# EasyEDA Pro project ProPrj_DOGlove_MainBoard.epro, schematic DOGlove_MainCircuit

## Sheets
1 STM32F042: Board Name: DOGlove_MainBoard; Create Date: 2025-04-19; Page Name: STM32F042; Project Name: DOGlove_MainBoard; Schematic Name: DOGlove_MainCircuit; Update Date: 2025-05-10; Company: Tsinghua TEA Lab; Page Size: A4; Version: V1.0
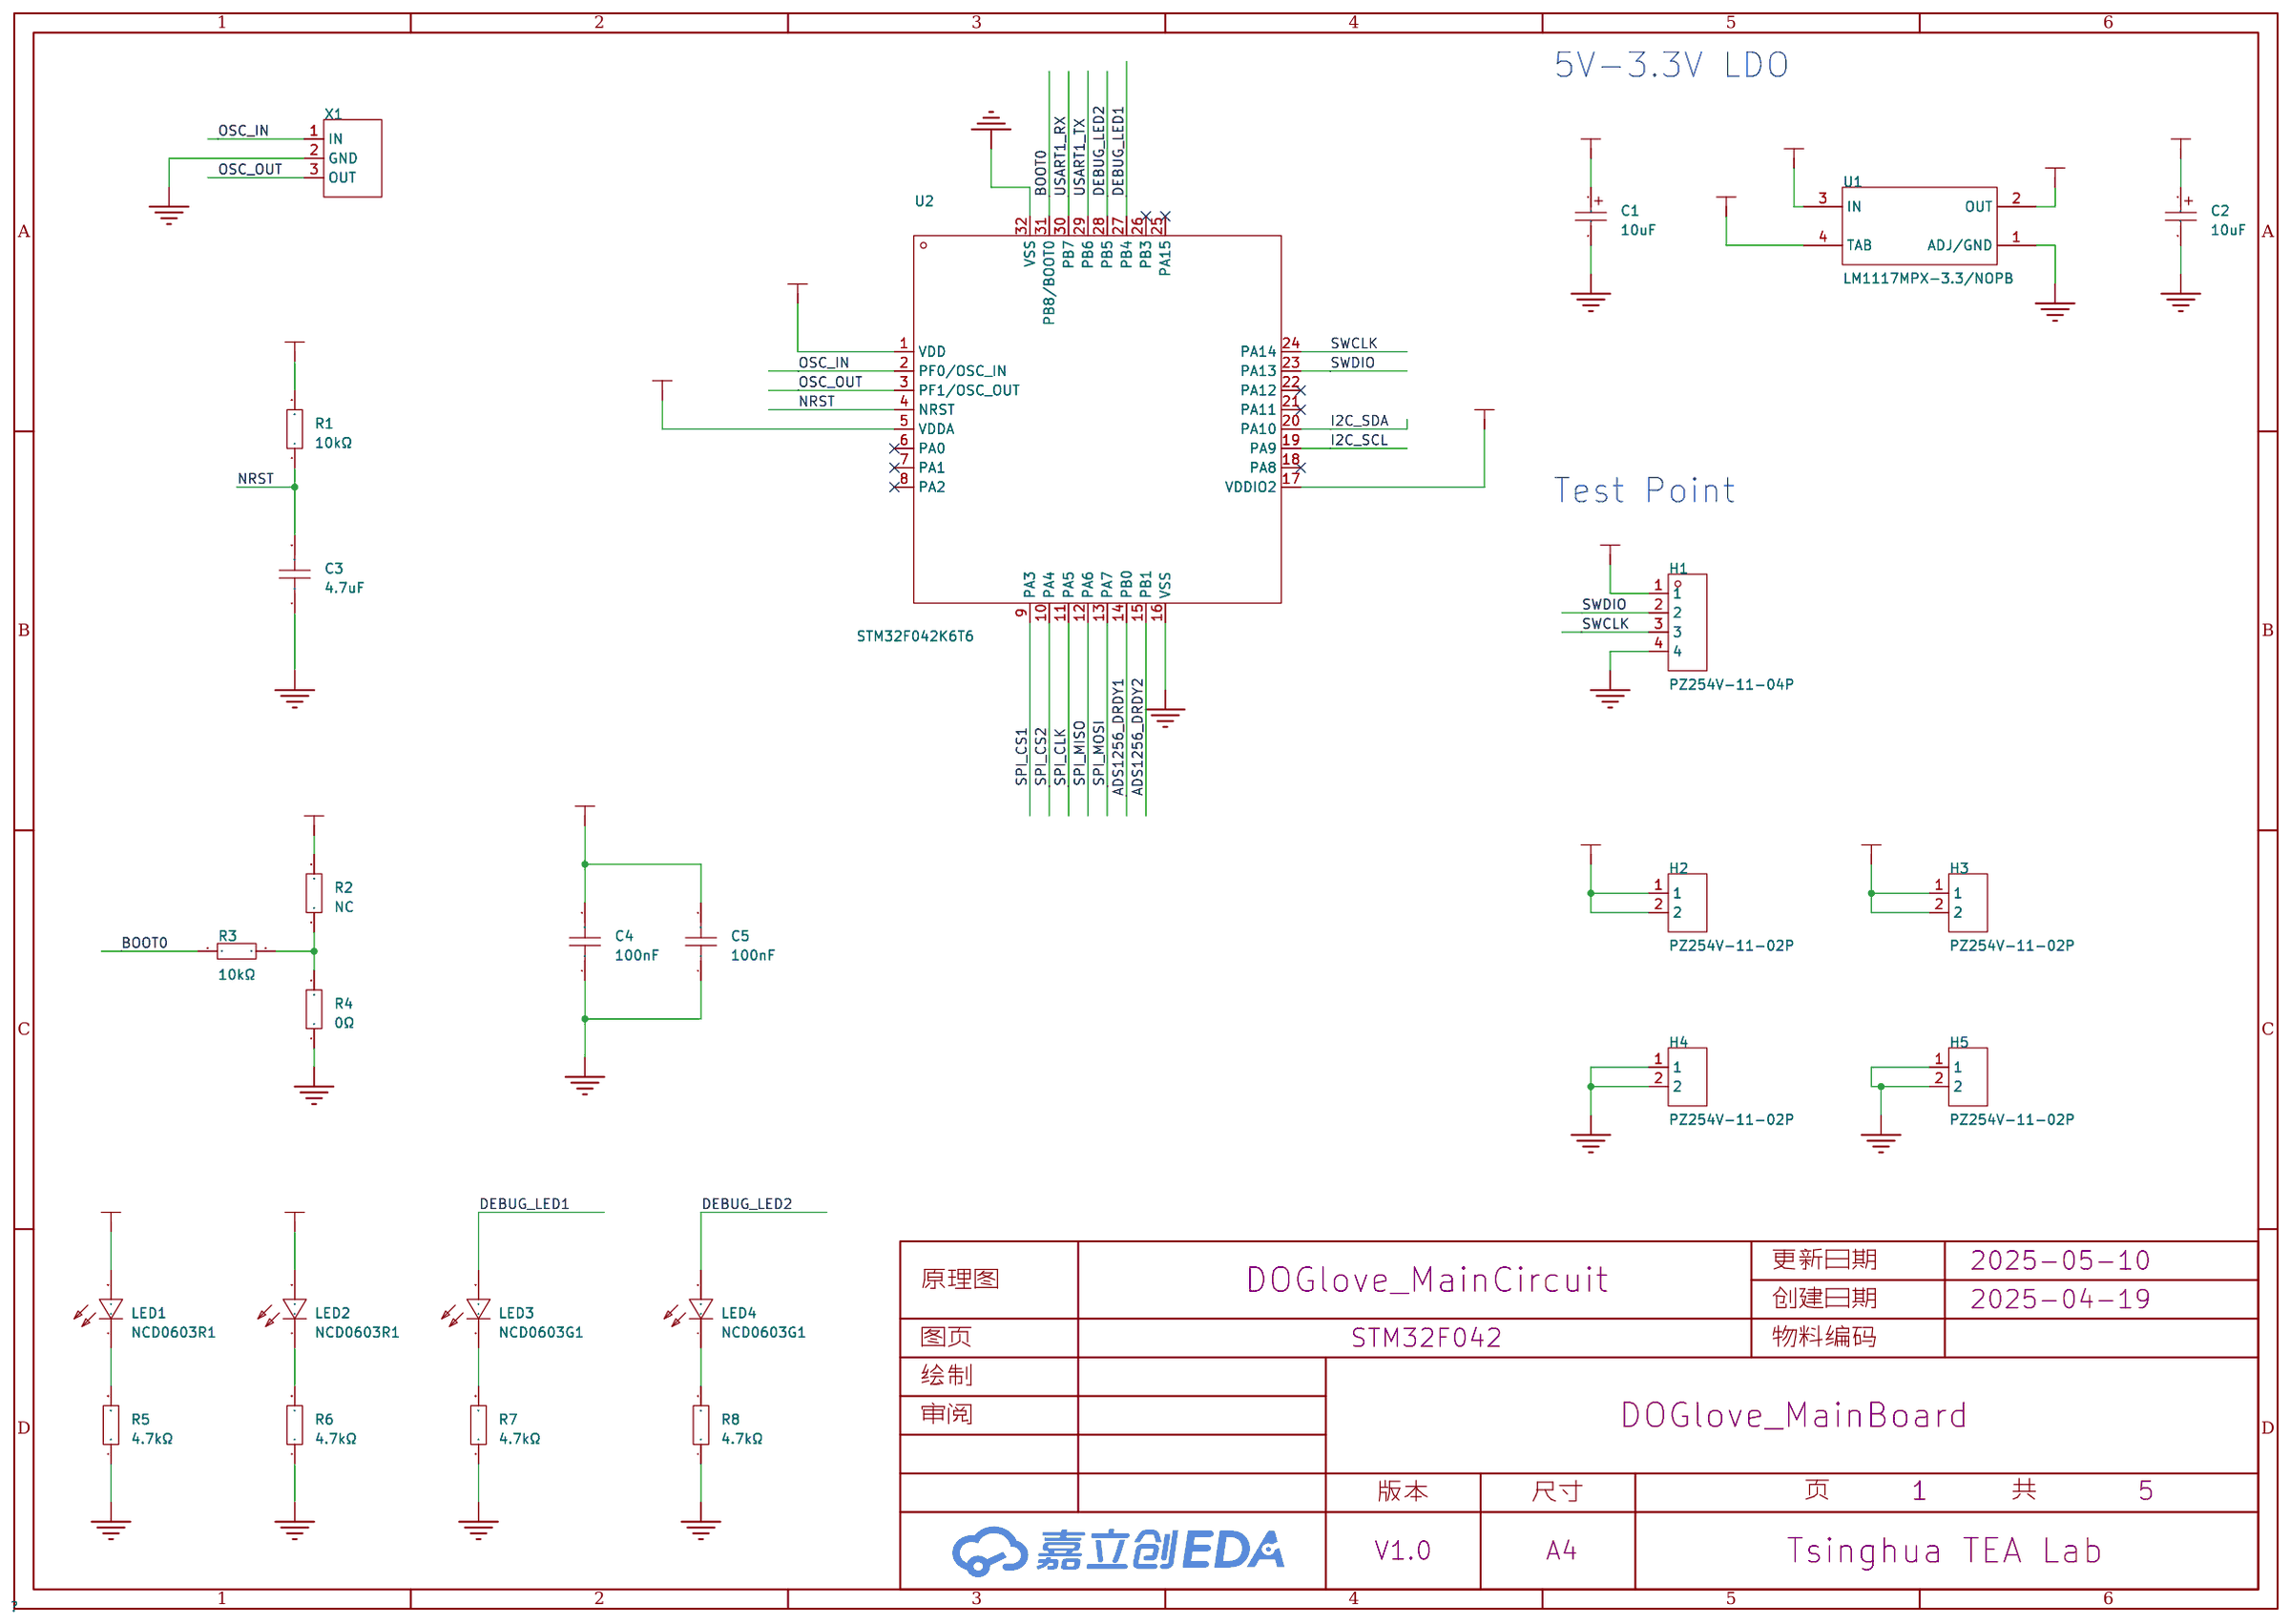
[diagram p0: STM32F042]
2 Joint_Encoder: Page Name: Joint_Encoder; Update Date: 2025-05-03
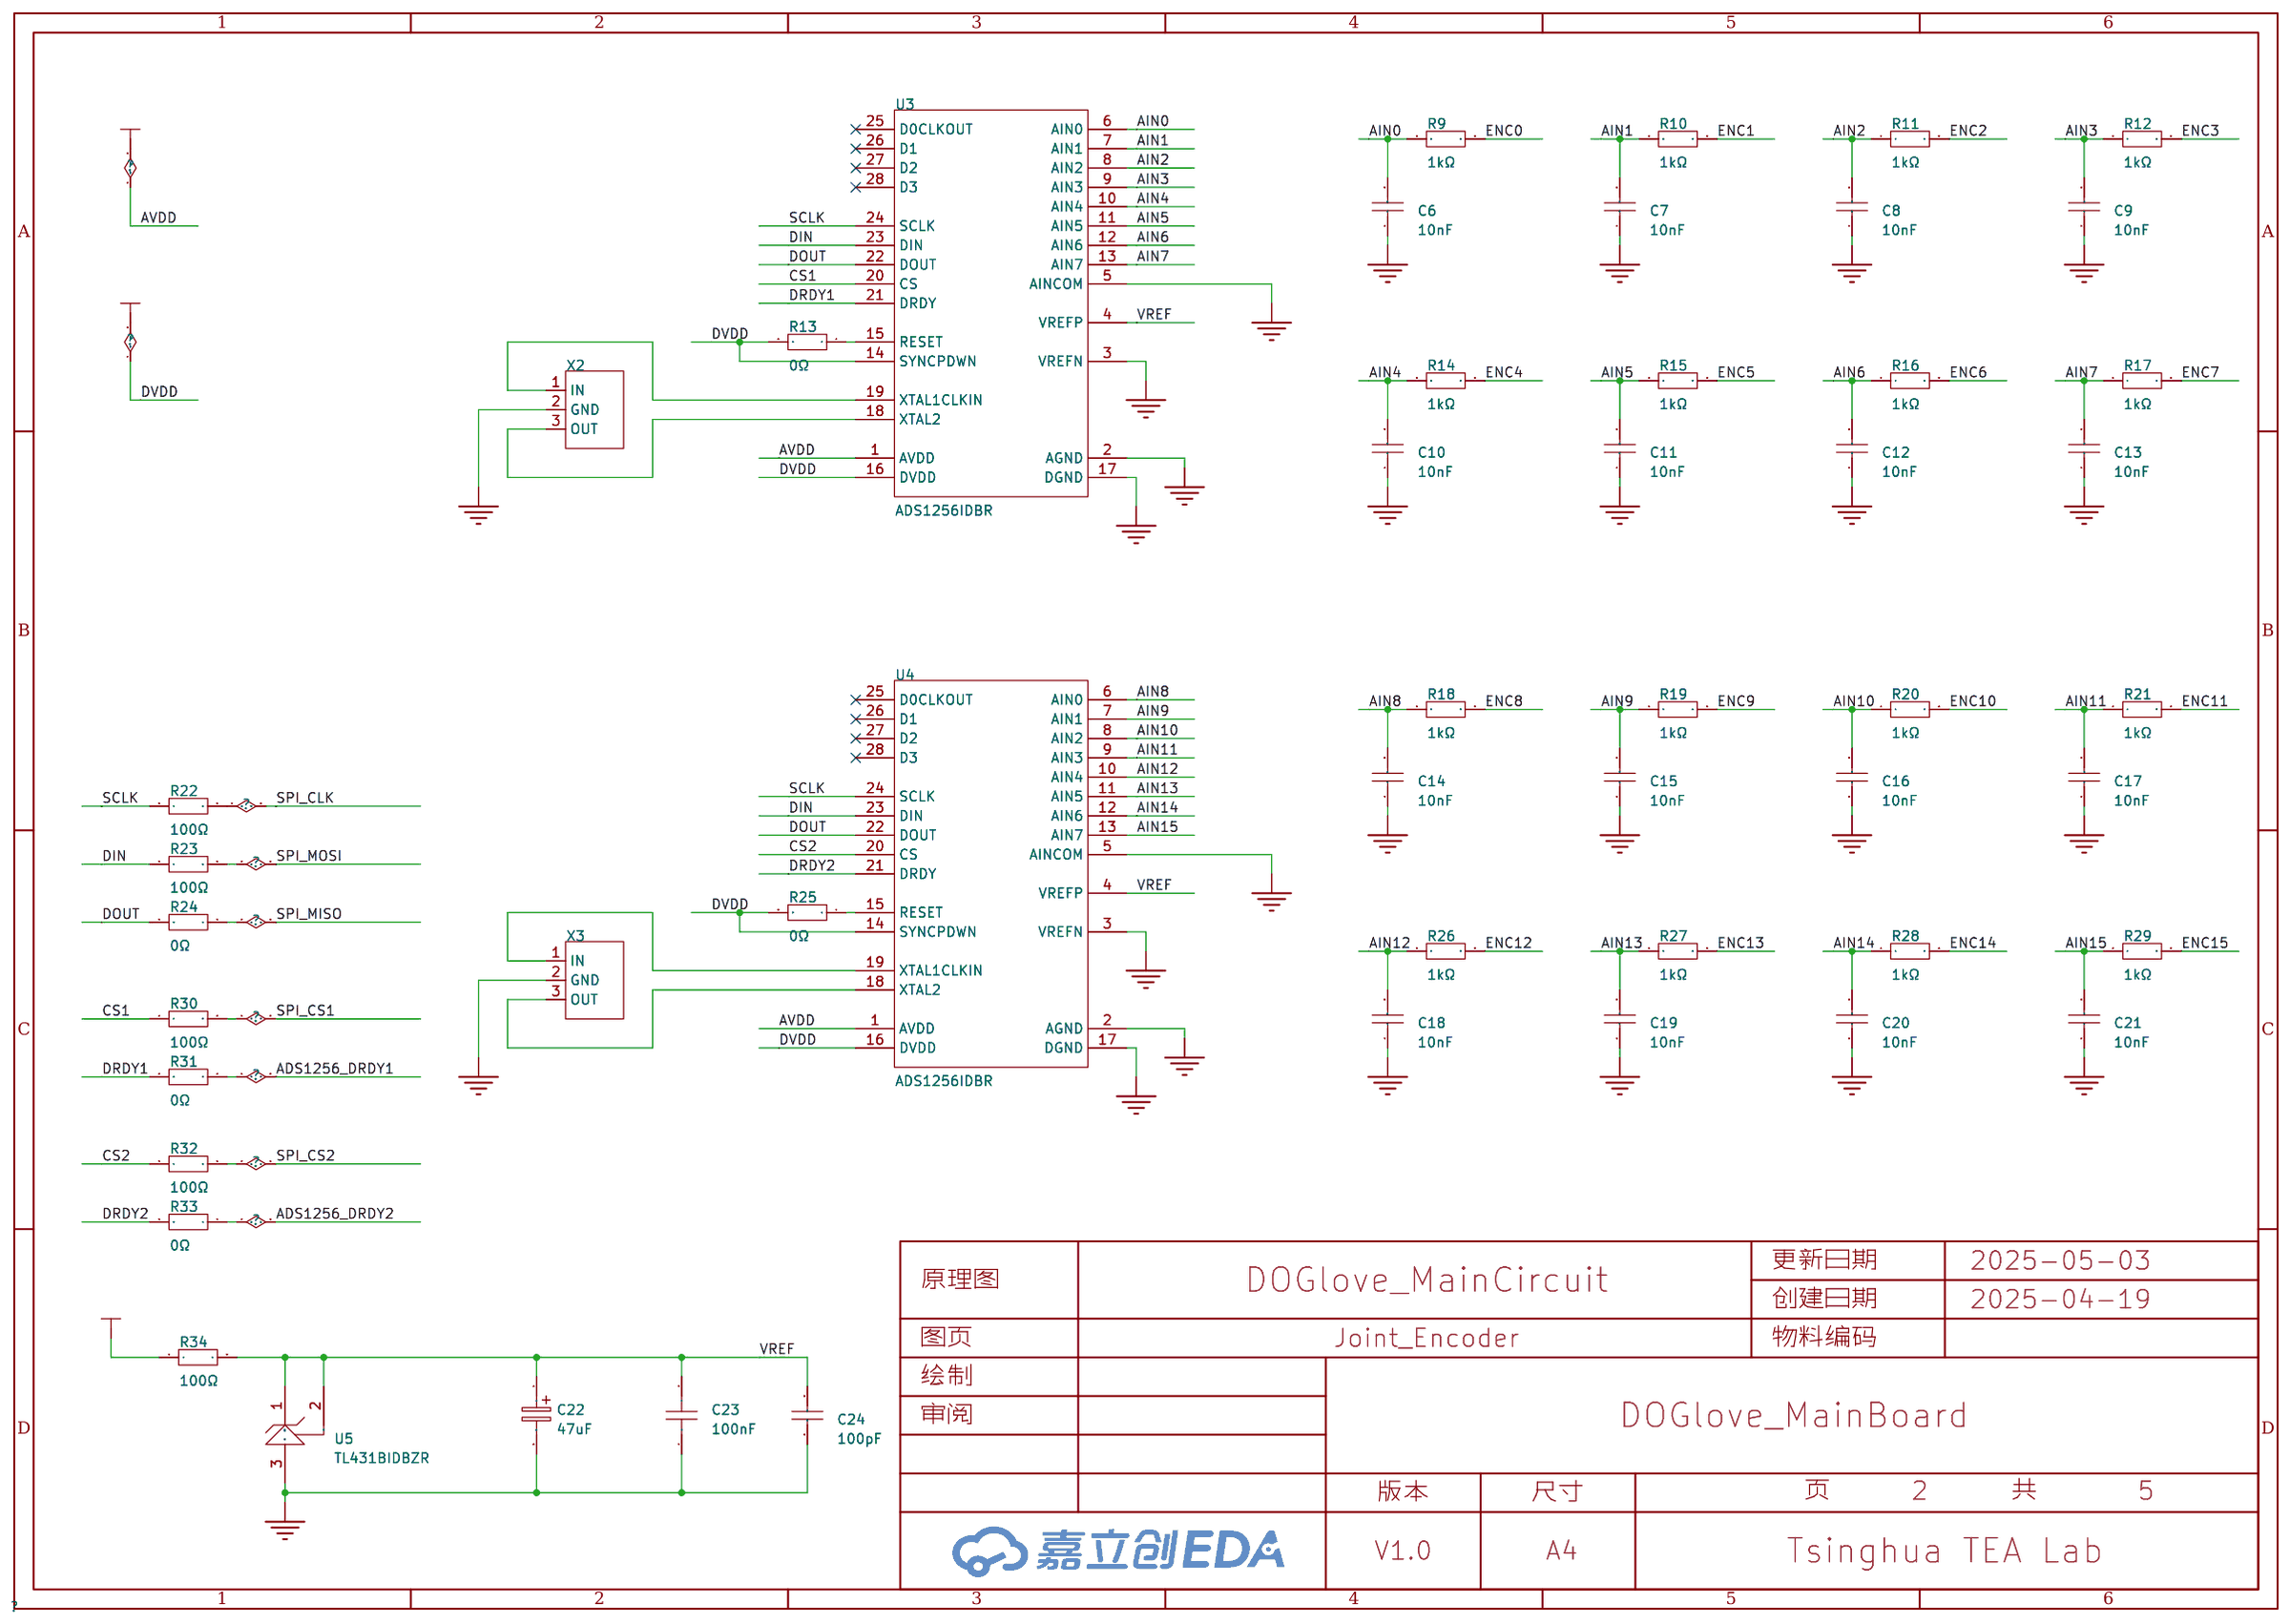
[diagram p1: Joint_Encoder]
3 LRA_Driver: Page Name: LRA_Driver; Update Date: 2025-05-03
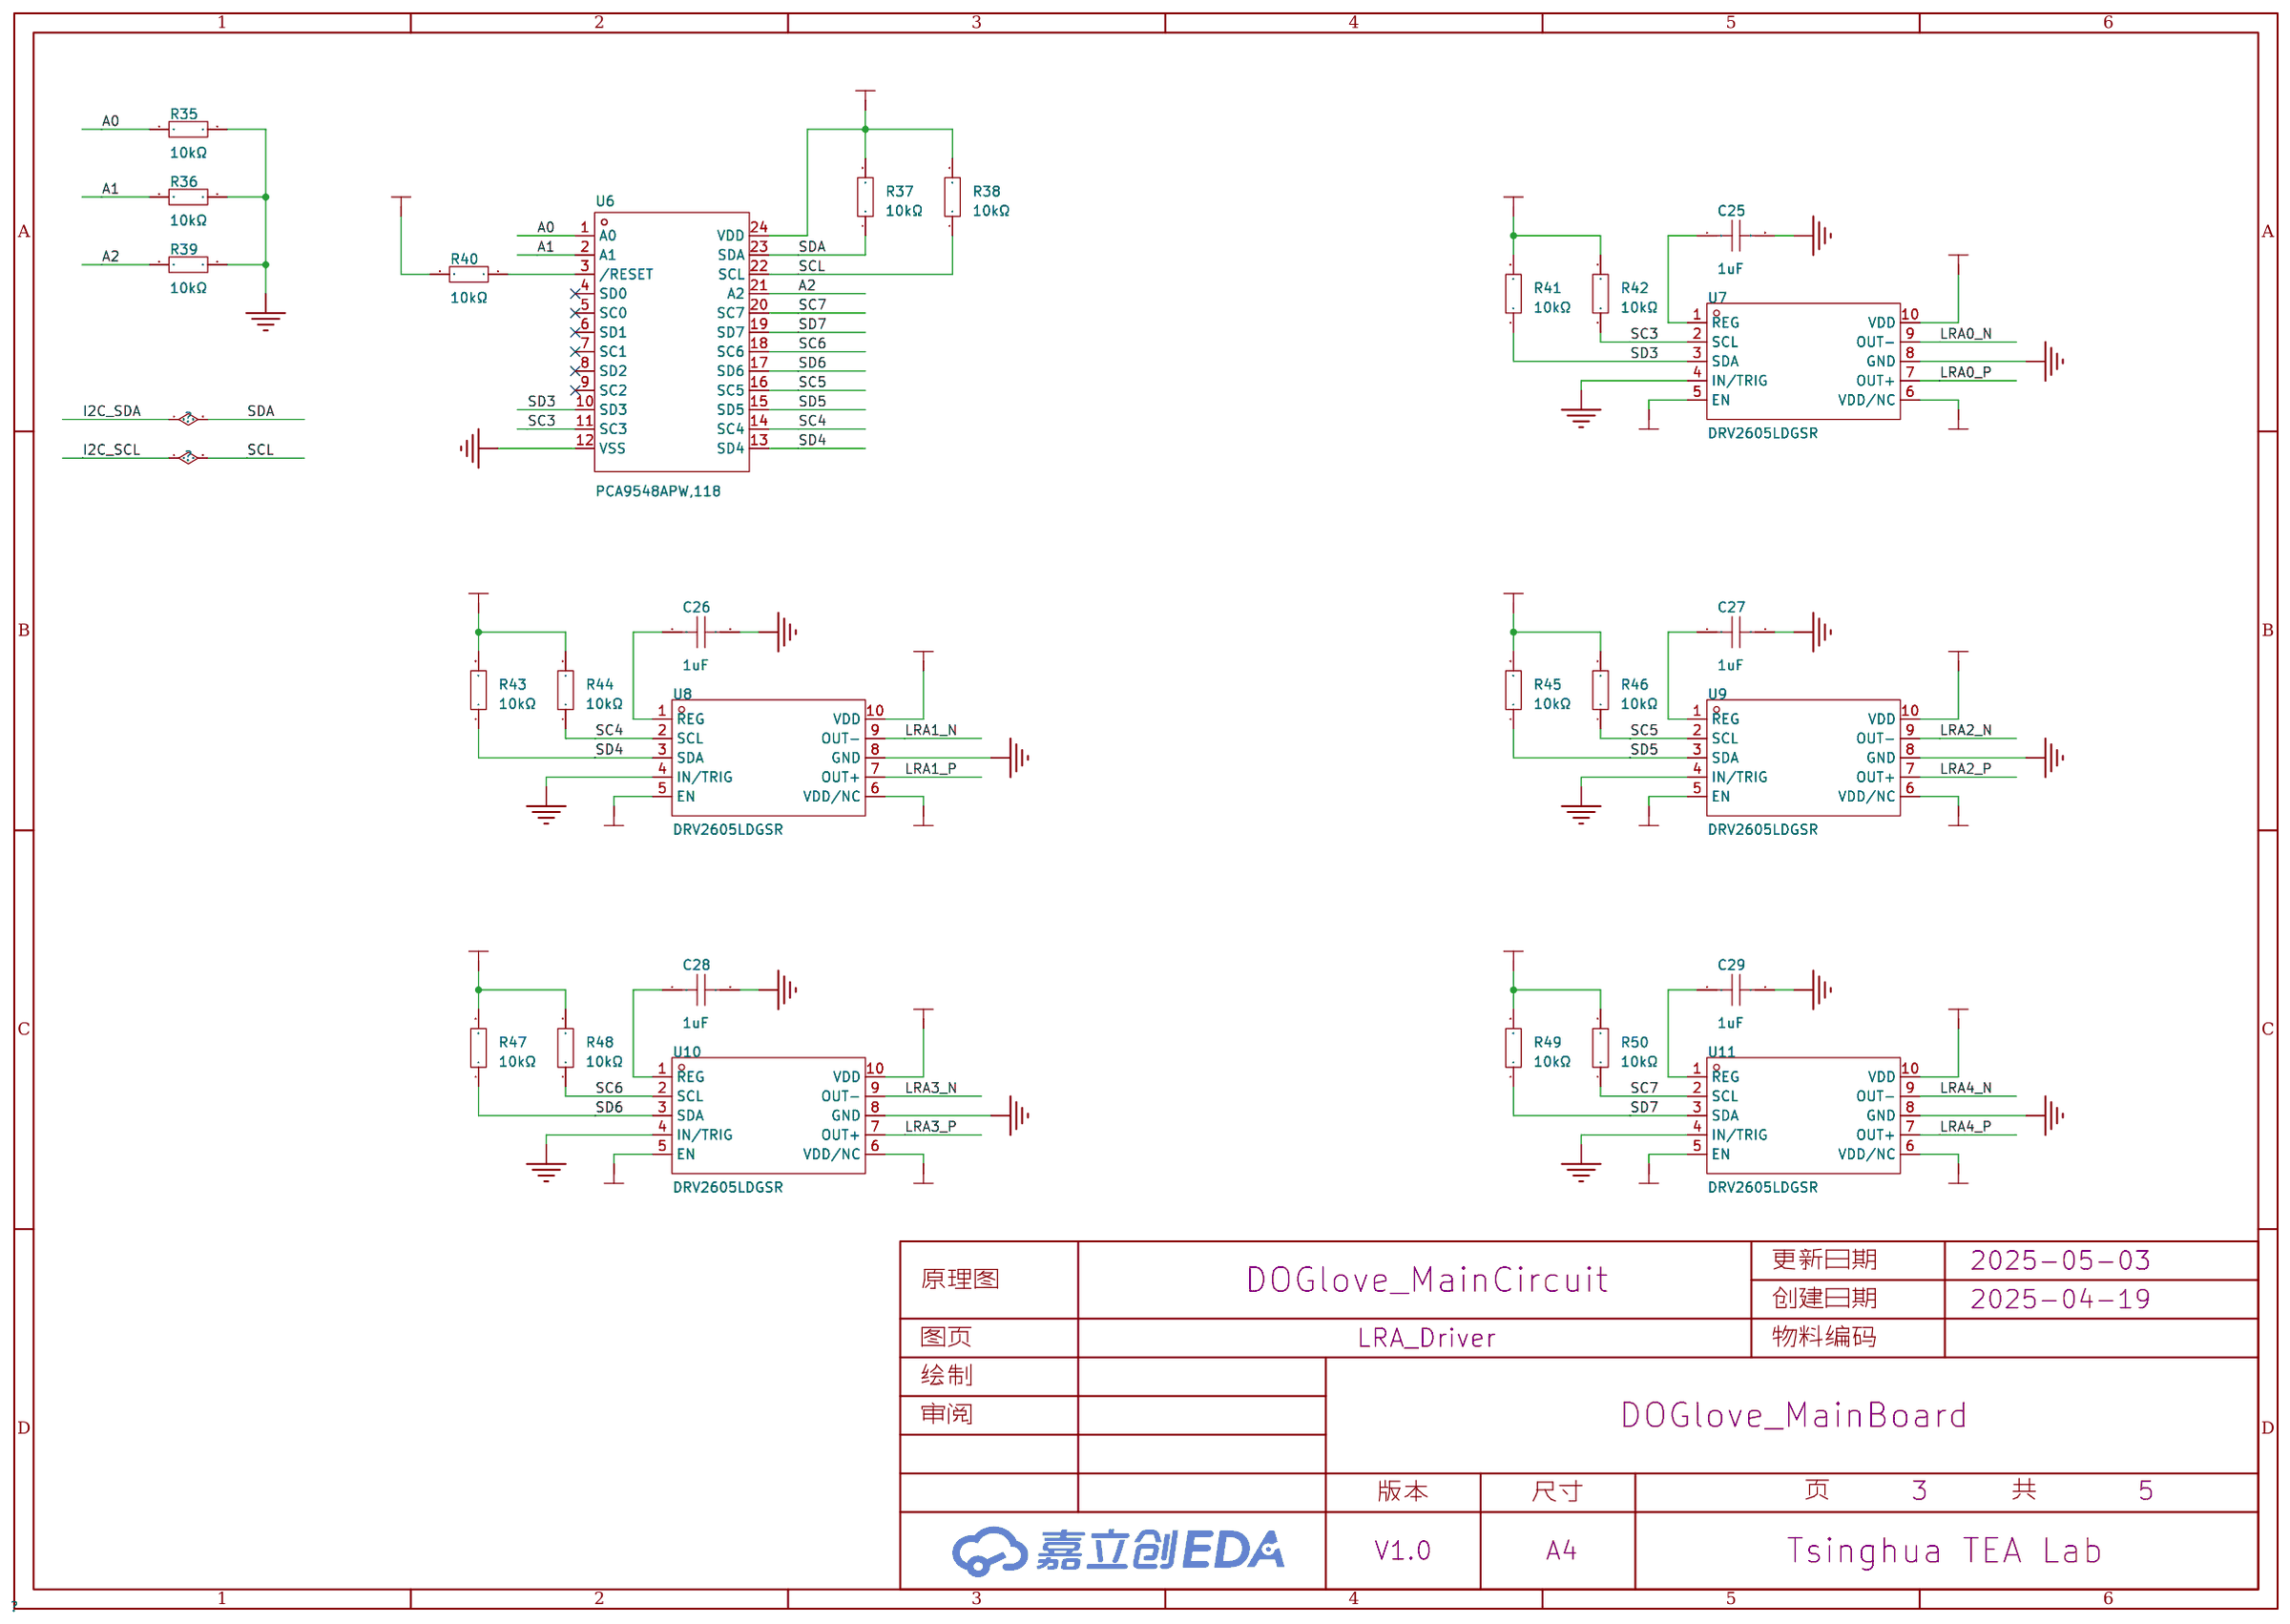
[diagram p2: LRA_Driver]
4 Internal_Connector: Page Name: Internal_Connector; Update Date: 2025-05-03
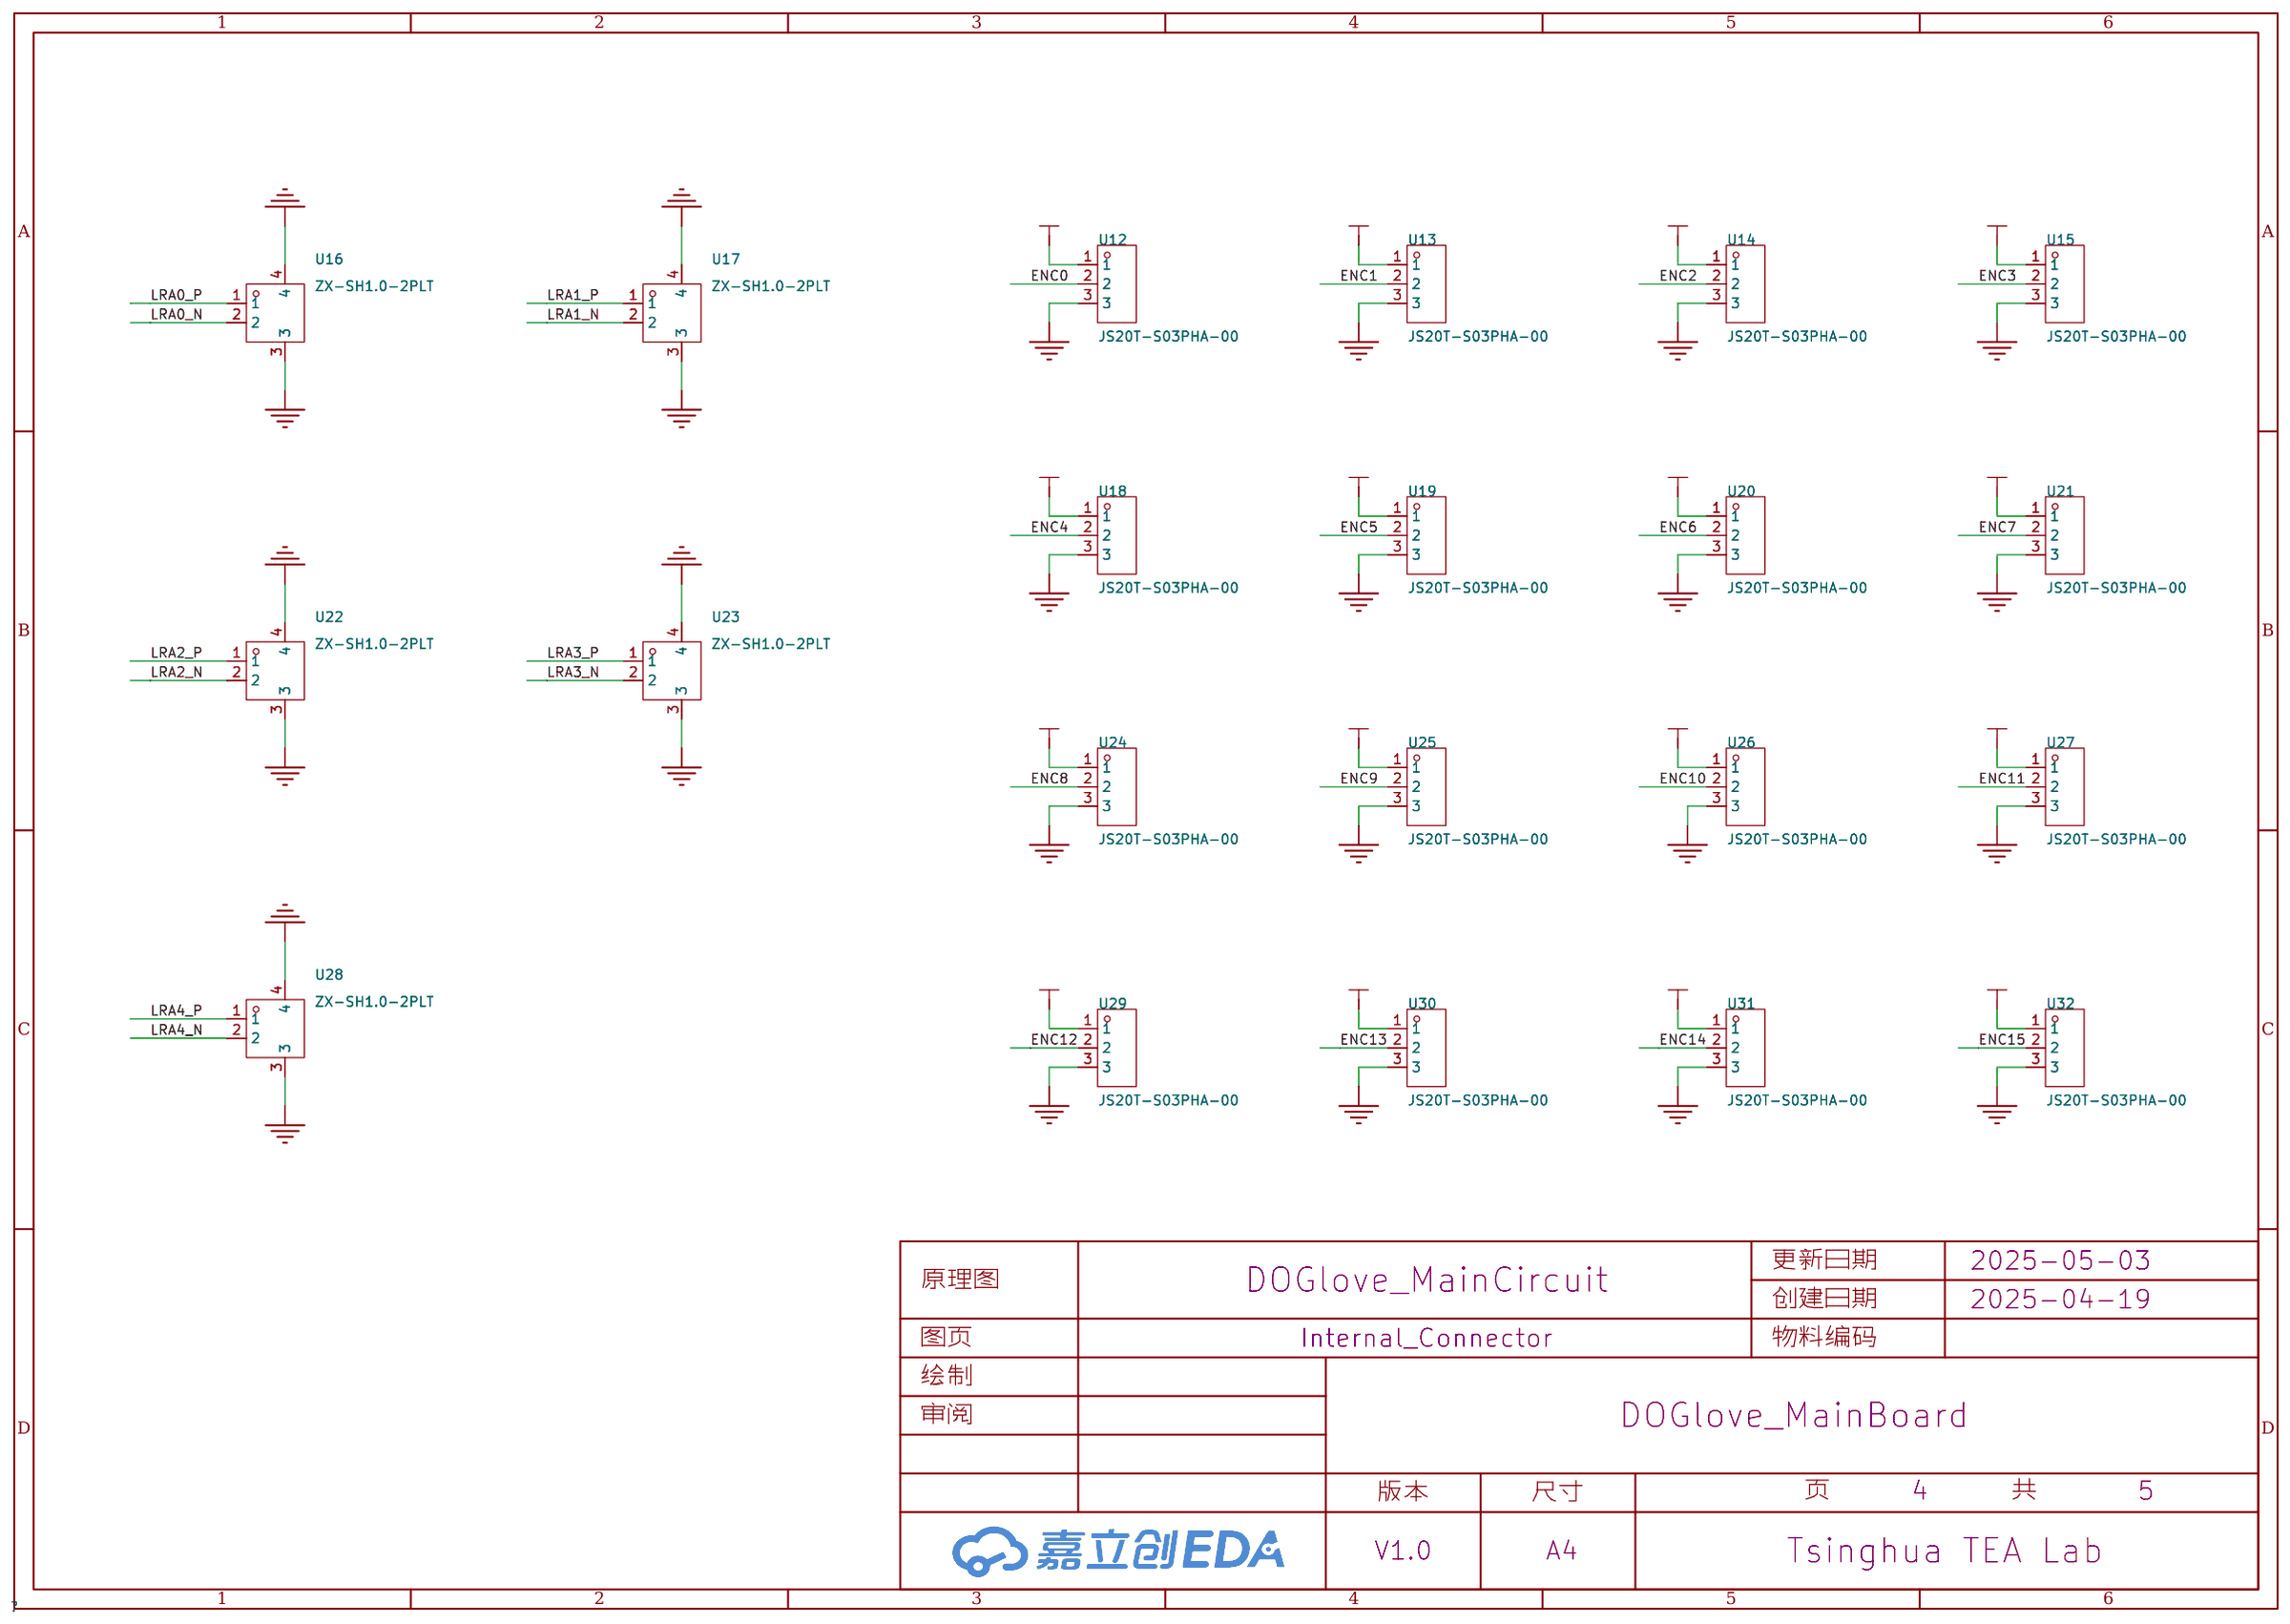
[diagram p3: Internal_Connector]
5 I_O: Page Name: I_O; Update Date: 2025-05-03
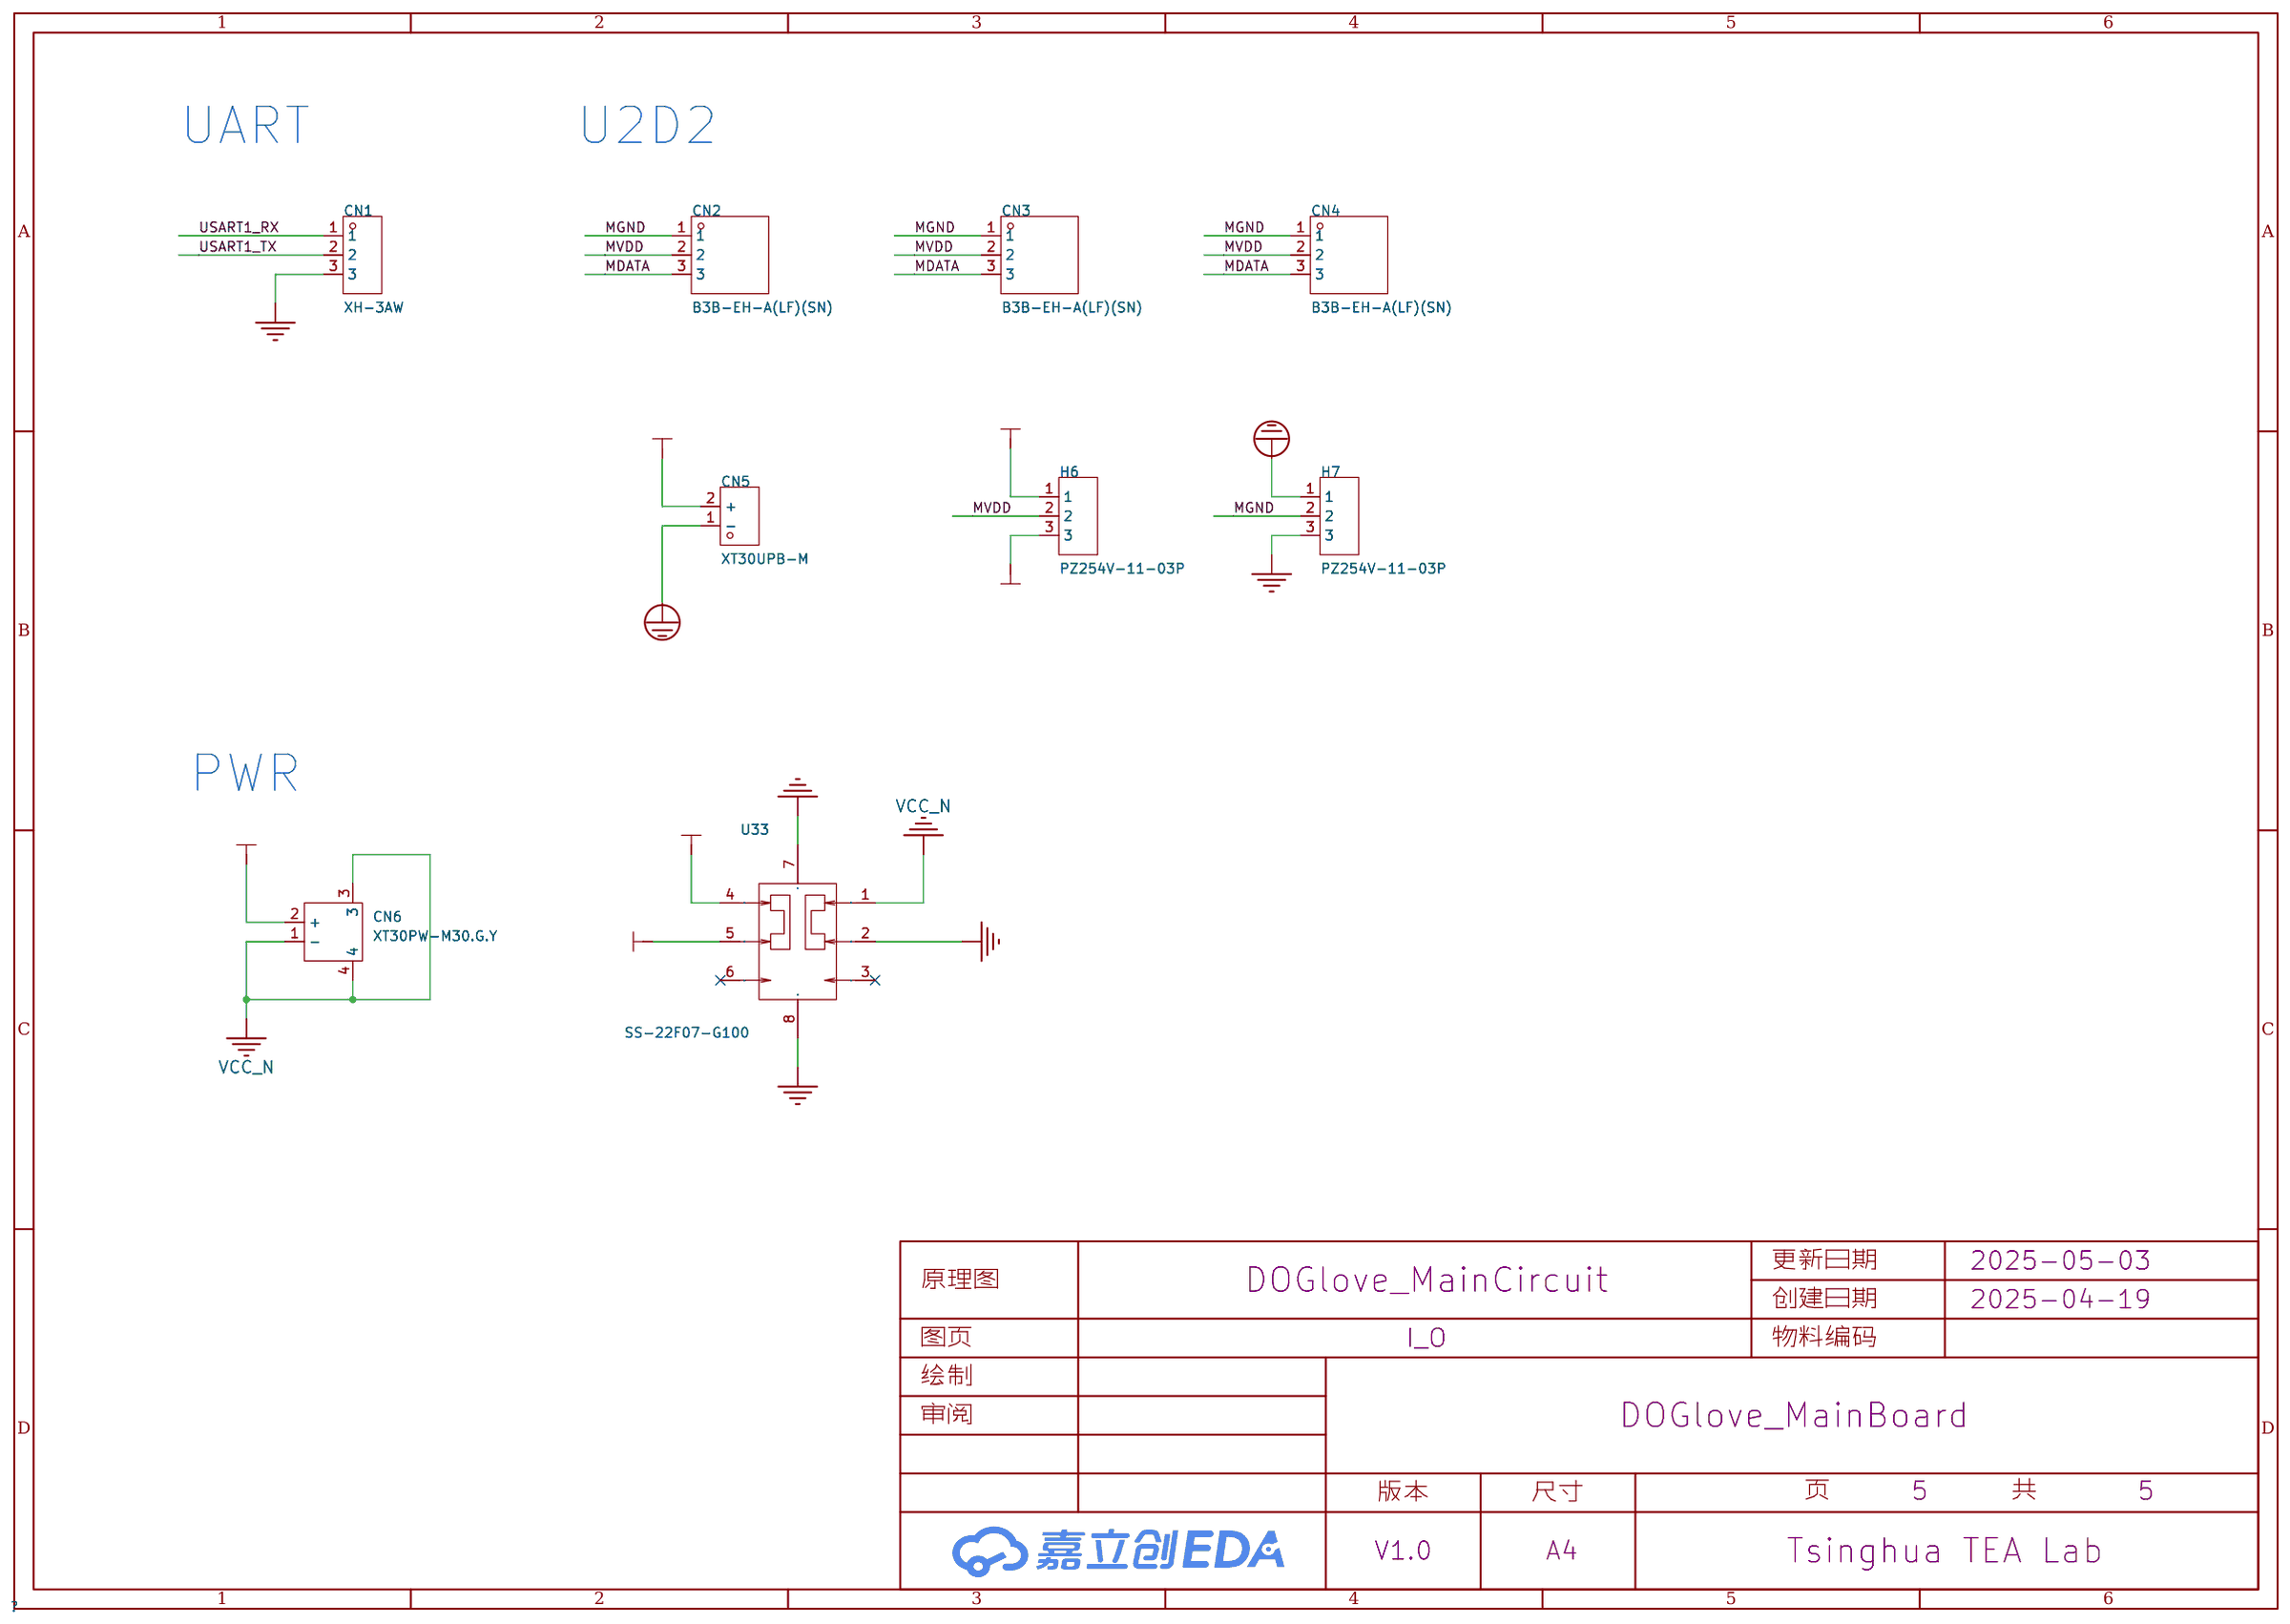
[diagram p4: I_O]

## Parts
sheet I_O
CN1  XH-3AW  [CONN-TH_3P-P2.54_HCTL_XH-3AW]
CN2  B3B-EH-A(LF)(SN)  [CONN-TH_B3B-EH-A-LF-SN]
CN3  B3B-EH-A(LF)(SN)  [CONN-TH_B3B-EH-A-LF-SN]
CN4  B3B-EH-A(LF)(SN)  [CONN-TH_B3B-EH-A-LF-SN]
CN5  XT30UPB-M  [CONN-TH_XT30UPB-M]
CN6  XT30PW-M30.G.Y  [CONN-TH_XT30PW-M]
H6  PZ254V-11-03P  [HDR-TH_3P-P2.54-V-M]
H7  PZ254V-11-03P  [HDR-TH_3P-P2.54-V-M]
U33  SS-22F07-G100  [SW-TH_6P-L16.5-W7.5-P4.0-LS2.6-TL]
sheet Internal_Connector
U12  JS20T-S03PHA-00  [CONN-TH_3P-P2.00_BX-PH2.0-3PZZ]
U13  JS20T-S03PHA-00  [CONN-TH_3P-P2.00_BX-PH2.0-3PZZ]
U14  JS20T-S03PHA-00  [CONN-TH_3P-P2.00_BX-PH2.0-3PZZ]
U15  JS20T-S03PHA-00  [CONN-TH_3P-P2.00_BX-PH2.0-3PZZ]
U16  ZX-SH1.0-2PLT  [CONN-SMD_2P-P1.00_MEGASTAR_ZX-SH1.0-2PLT]
U17  ZX-SH1.0-2PLT  [CONN-SMD_2P-P1.00_MEGASTAR_ZX-SH1.0-2PLT]
U18  JS20T-S03PHA-00  [CONN-TH_3P-P2.00_BX-PH2.0-3PZZ]
U19  JS20T-S03PHA-00  [CONN-TH_3P-P2.00_BX-PH2.0-3PZZ]
U20  JS20T-S03PHA-00  [CONN-TH_3P-P2.00_BX-PH2.0-3PZZ]
U21  JS20T-S03PHA-00  [CONN-TH_3P-P2.00_BX-PH2.0-3PZZ]
U22  ZX-SH1.0-2PLT  [CONN-SMD_2P-P1.00_MEGASTAR_ZX-SH1.0-2PLT]
U23  ZX-SH1.0-2PLT  [CONN-SMD_2P-P1.00_MEGASTAR_ZX-SH1.0-2PLT]
U24  JS20T-S03PHA-00  [CONN-TH_3P-P2.00_BX-PH2.0-3PZZ]
U25  JS20T-S03PHA-00  [CONN-TH_3P-P2.00_BX-PH2.0-3PZZ]
U26  JS20T-S03PHA-00  [CONN-TH_3P-P2.00_BX-PH2.0-3PZZ]
U27  JS20T-S03PHA-00  [CONN-TH_3P-P2.00_BX-PH2.0-3PZZ]
U28  ZX-SH1.0-2PLT  [CONN-SMD_2P-P1.00_MEGASTAR_ZX-SH1.0-2PLT]
U29  JS20T-S03PHA-00  [CONN-TH_3P-P2.00_BX-PH2.0-3PZZ]
U30  JS20T-S03PHA-00  [CONN-TH_3P-P2.00_BX-PH2.0-3PZZ]
U31  JS20T-S03PHA-00  [CONN-TH_3P-P2.00_BX-PH2.0-3PZZ]
U32  JS20T-S03PHA-00  [CONN-TH_3P-P2.00_BX-PH2.0-3PZZ]
sheet Joint_Encoder
C6  10nF  [C0603]
C7  10nF  [C0603]
C8  10nF  [C0603]
C9  10nF  [C0603]
C10  10nF  [C0603]
C11  10nF  [C0603]
C12  10nF  [C0603]
C13  10nF  [C0603]
C14  10nF  [C0603]
C15  10nF  [C0603]
C16  10nF  [C0603]
C17  10nF  [C0603]
C18  10nF  [C0603]
C19  10nF  [C0603]
C20  10nF  [C0603]
C21  10nF  [C0603]
C22  47uF  [CAP-SMD_L3.5-W2.8-R-RD]
C23  100nF  [C0603]
C24  100pF  [C0603]
R9  1kΩ  [R0603]
R10  1kΩ  [R0603]
R11  1kΩ  [R0603]
R12  1kΩ  [R0603]
R13  0Ω  [R0603]
R14  1kΩ  [R0603]
R15  1kΩ  [R0603]
R16  1kΩ  [R0603]
R17  1kΩ  [R0603]
R18  1kΩ  [R0603]
R19  1kΩ  [R0603]
R20  1kΩ  [R0603]
R21  1kΩ  [R0603]
R22  100Ω  [R0603]
R23  100Ω  [R0603]
R24  0Ω  [R0603]
R25  0Ω  [R0603]
R26  1kΩ  [R0603]
R27  1kΩ  [R0603]
R28  1kΩ  [R0603]
R29  1kΩ  [R0603]
R30  100Ω  [R0603]
R31  0Ω  [R0603]
R32  100Ω  [R0603]
R33  0Ω  [R0603]
R34  100Ω  [R0603]
U3  ADS1256IDBR  [SSOP-28_L10.2-W5.3-P0.65-LS7.8-BL]
U4  ADS1256IDBR  [SSOP-28_L10.2-W5.3-P0.65-LS7.8-BL]
U5  TL431BIDBZR  [SOT-23-3_L2.9-W1.3-P1.90-LS2.4-BR]
X2  -  [OSC-SMD_3P-L3.2-W1.3-P1.20]
X3  -  [OSC-SMD_3P-L3.2-W1.3-P1.20]
sheet LRA_Driver
C25  1uF  [C0603]
C26  1uF  [C0603]
C27  1uF  [C0603]
C28  1uF  [C0603]
C29  1uF  [C0603]
R35  10kΩ  [R0603]
R36  10kΩ  [R0603]
R37  10kΩ  [R0603]
R38  10kΩ  [R0603]
R39  10kΩ  [R0603]
R40  10kΩ  [R0603]
R41  10kΩ  [R0603]
R42  10kΩ  [R0603]
R43  10kΩ  [R0603]
R44  10kΩ  [R0603]
R45  10kΩ  [R0603]
R46  10kΩ  [R0603]
R47  10kΩ  [R0603]
R48  10kΩ  [R0603]
R49  10kΩ  [R0603]
R50  10kΩ  [R0603]
U6  PCA9548APW,118  [TSSOP-24_L7.8-W4.4-P0.65-LS6.4-BL]
U7  DRV2605LDGSR  [VSSOP-10_L3.0-W3.0-P0.50-LS4.9-BL]
U8  DRV2605LDGSR  [VSSOP-10_L3.0-W3.0-P0.50-LS4.9-BL]
U9  DRV2605LDGSR  [VSSOP-10_L3.0-W3.0-P0.50-LS4.9-BL]
U10  DRV2605LDGSR  [VSSOP-10_L3.0-W3.0-P0.50-LS4.9-BL]
U11  DRV2605LDGSR  [VSSOP-10_L3.0-W3.0-P0.50-LS4.9-BL]
sheet STM32F042
C1  10uF  [CASE-C_6032]
C2  10uF  [CASE-C_6032]
C3  4.7uF  [C0603]
C4  100nF  [C0603]
C5  100nF  [C0603]
H1  PZ254V-11-04P  [HDR-TH_4P-P2.54-V-M]
H2  PZ254V-11-02P  [HDR-TH_2P-P2.54-V-M]
H3  PZ254V-11-02P  [HDR-TH_2P-P2.54-V-M]
H4  PZ254V-11-02P  [HDR-TH_2P-P2.54-V-M]
H5  PZ254V-11-02P  [HDR-TH_2P-P2.54-V-M]
LED1  NCD0603R1  [LED0603-RD_RED]
LED2  NCD0603R1  [LED0603-RD_RED]
LED3  NCD0603G1  [LED0603-RD_1]
LED4  NCD0603G1  [LED0603-RD_1]
R1  10kΩ  [R0603]
R2  NC  [R0603]
R3  10kΩ  [R0603]
R4  0Ω  [R0603]
R5  4.7kΩ  [R0603]
R6  4.7kΩ  [R0603]
R7  4.7kΩ  [R0603]
R8  4.7kΩ  [R0603]
U1  LM1117MPX-3.3/NOPB  [SOT-223-3_L6.5-W3.4-P2.30-LS7.0-BR]
U2  STM32F042K6T6  [LQFP-32_L7.0-W7.0-P0.80-LS9.0-BL]
X1  -  [OSC-SMD_3P-L3.2-W1.3-P1.20]

## Library data of the parts
CN1 = XH-3AW_C2908612: 插针结构:1x3P;间距:2.54mm;安装方式:弯插;参考系列:XH;总PIN数:3P;排数:1;每排PIN数:3;行距:-;额定电流:3A;触头材质:黄铜;触头镀层:锡;工作温度范围:-25℃~+85℃;; LCSC Part Name: 1x3P 间距:2.54mm 弯插 系列:XH; Supplier Part: C2908612; Manufacturer: HCTL(华灿天禄); Supplier Footprint: 弯插,P=2.5mm; JLCPCB Part Class: Extended Part; Datasheet: https://atta.szlcsc.com/upload/public/pdf/source/20230711/B565BAF3B11666EF6B81B3605408F2BD.pdf; Supplier: LCSC; Pins Structure: 1x3P; Pitch: 2.54mm; Mounting Style: 弯插; Reference Series: XH; Number of Pins: 3P; Number of Rows: 1; Number of PINs Per Row: 3; Current Rating (Max): 3A; Contact Material: 黄铜; Contact Plating: 锡; Operating Temperature Range: -25℃~+85℃
CN2-CN4 = B3B-EH-A(LF)(SN): 插针结构:1x3P;间距:2.5mm;安装方式:直插;参考系列:EH;总PIN数:3P;排数:1;每排PIN数:3;行距:-;额定电流:3A;触头材质:黄铜;触头镀层:锡;工作温度范围:-25℃~+85℃;; LCSC Part Name: 1x3P 间距:2.5mm 直插 系列:EH; Supplier Part: C160259; Manufacturer: JST; Supplier Footprint: 插件,P=2.5mm; JLCPCB Part Class: Extended Part; Datasheet: https://atta.szlcsc.com/upload/public/pdf/source/20180829/C265103_11C5AD83FCD48B5E904586D0E75EE570.pdf; Supplier: LCSC; Pins Structure: 1x3P; Pitch: 2.5mm; Mounting Style: 直插; Reference Series: EH; Number of Pins: 3P; Number of Rows: 1; Number of PINs Per Row: 3; Current Rating (Max): 3A; Contact Material: 黄铜; Contact Plating: 锡; Operating Temperature Range: -25℃~+85℃; Rated Voltage (Max): 250V; Plastic Material: PA66; Flame Retardant Rating: UL94V-0; Supplementary Features: 打K脚; Colour: 白色; Z-Height of the Board: 6mm; X-Length of Bottom Edge on Board (Spacing Line): 10mm; Y-Width of Bottom Edge on Board: 3.8mm
CN5 = XT30UPB-M: 类别:-;类型1:-;; LCSC Part Name: AMASS(艾迈斯)板载立式 航模锂电池控制器连接器插头 公头XT30UPB-M; Supplier Part: C428721; Manufacturer: AMASS(艾迈斯); JLCPCB Part Class: Extended Part; Datasheet: https://atta.szlcsc.com/upload/public/pdf/source/20230412/7B5DFEF57C9EA5273853390C734B3AC5.pdf; Supplier: LCSC; Brand: 艾迈斯; Type: 航模插头; Colour: 黄色; RatedVoltage: DC 500V; InterfaceType: 公头; MetalMaterial: 镀金; InsulationMaterial: PA; RatedCurrent: 15A; contact resistance: 0.65mΩ
CN6 = XT30PW-M30.G.Y: 类别:-;类型1:-;; LCSC Part Name: AMASS(艾迈斯)航模插头 卧式弯脚 XT30PW-M公头; Supplier Part: C431092; Manufacturer: AMASS(艾迈斯); JLCPCB Part Class: Extended Part; Datasheet: https://atta.szlcsc.com/upload/public/pdf/source/20220222/6A9F22F7850E25B33E1BE430ADF8560B.pdf; Supplier: LCSC; Type: 航模插头; RatedVoltage: DC 500V; InterfaceType: 公头; RatedCurrent: 15A; RecommendedWireGauge: 16/18/20AWG; contact resistance: 1.2mΩ; specifications: 2pin
H6 H7 = PZ254V-11-03P: 插针结构:1x3P;间距:2.54mm;行距:-;圆针/方针:方针;安装方式:直插;排数:单排;总PIN位数:3P;额定电流:3A;额定电压:250V;配合针长度:6mm;塑高:2.5mm;端接针长度:3mm;工作温度:-40℃~+105℃;颜色:黑色;; LCSC Part Name: 1x3P 间距:2.54mm 方针 直插; Supplier Part: C2937625; Manufacturer: XFCN(兴飞); Supplier Footprint: 插件,P=2.54mm; JLCPCB Part Class: Extended Part; Datasheet: https://atta.szlcsc.com/upload/public/pdf/source/20200309/C492402_8335C3D49C4E4C618838D59BB1D024C1.pdf; Supplier: LCSC; Pin Structure: 1x3P; Pitch: 2.54mm; Circluar Pins/Square Pins: 方针; Mounting Type: 直插; Number of Rows: 单排; Number of Pins: 3P; Current Rating: 3A; Voltage Rating (Max): 250V; Length of Mating Pin: 6mm; Insulation Height: 2.5mm; Length of End Connection Pin: 3mm; Operating Temperature: -40℃~+105℃; Color: 黑色
U33 = SS-22F07-G100: 开关颜色:黑色;额定电流(DC):1A;额定电压(DC):24V;; LCSC Part Name: 拨动开关SS-22F07 柄高10mm; Supplier Part: C5446810; Manufacturer: G-Switch(品赞); Supplier Footprint: 插件; JLCPCB Part Class: Extended Part; Datasheet: https://atta.szlcsc.com/upload/public/pdf/source/20210728/C2848924_9F44589EA412D8E62CA97BAE44F5AD1F.pdf; Supplier: LCSC; Actuator Color: 黑色; Current Rating (DC): 1A; Voltage Rating (DC): 24V; Operating Temperature: -25℃~+70℃
U12-U15 U18-U21 U24-U27 U29-U32 = JS20T-S03PHA-00: 插针结构:1x3P;间距:2mm;安装方式:直插;参考系列:PH;总PIN数:3P;排数:1;每排PIN数:3;触头材质:黄铜;; Supplier Part: C7499293; Manufacturer: JS(钜硕电子); Supplier Footprint: 插件,P=2.0mm; JLCPCB Part Class: Extended Part; Datasheet: https://atta.szlcsc.com/upload/public/pdf/source/20230809/0B0E714A4A3422D13A394C209A8084D0.pdf; Supplier: LCSC; Pins Structure: 1x3P; Pitch: 2mm; Mounting Style: 直插; Reference Series: PH; Number of Pins: 3P; Number of Rows: 1; Number of PINs Per Row: 3; Contact Material: 黄铜
U16 U17 U22 U23 U28 = ZX-SH1.0-2PLT: 插针结构:1x2P;间距:1mm;安装方式:立贴;参考系列:SH;总PIN数:2P;排数:1;每排PIN数:2;行距:-;额定电流:-;触头材质:黄铜;触头镀层:锡;工作温度范围:-;; LCSC Part Name: 1x2P 间距:1mm 立贴 系列:SH; Supplier Part: C7430451; Manufacturer: Megastar(兆星); Supplier Footprint: SMD,P=1mm; JLCPCB Part Class: Extended Part; Datasheet: https://atta.szlcsc.com/upload/public/pdf/source/20230619/55758099097F5A7B1A19E58445BD7C34.pdf; Supplier: LCSC; Pins Structure: 1x2P; Pitch: 1mm; Mounting Style: 立贴; Reference Series: SH; Number of Pins: 2P; Number of Rows: 1; Number of PINs Per Row: 2; Contact Material: 黄铜; Contact Plating: 锡; Supplementary Features: 辅助焊脚; Colour: 米色; Z-Height of the Board: 4.4mm; X-Length of Bottom Edge on Board (Spacing Line): 4.35mm; Y-Width of Bottom Edge on Board: 3.74mm
C6-C21 = CC0603JRX7R9BB103: 容值:10nF;精度:±5%;额定电压:50V;材质(温度系数):X7R;; LCSC Part Name: 10nF ±5% 50V; Supplier Part: C115056; Manufacturer: YAGEO(国巨); Supplier Footprint: 0603; JLCPCB Part Class: Extended Part; Datasheet: https://atta.szlcsc.com/upload/public/pdf/source/20170919/C131031_1505787245477976978.pdf; Supplier: LCSC; Tolerance: ±5%; Voltage Rated: 50V; Temperature Coefficient: X7R
C22 = CA45-B-16V-47uF-K: 容值:47uF;精度:±10%;额定电压:16V;等效串联电阻(ESR):3Ω@100kHz;; LCSC Part Name: 47uF ±10% 16V; Supplier Part: C136751; Manufacturer: CEC(振华新云); Supplier Footprint: CASE-B-3528-19(mm); JLCPCB Part Class: Extended Part; Datasheet: https://atta.szlcsc.com/upload/public/pdf/source/20200817/C136751_89CB14FC7BB434027D9410E248BC6FA3.pdf; Supplier: LCSC; Tolerance: ±10%; Voltage Rating: 16V; Equivalent Series Resistance(ESR): 3Ω@100kHz; Operating Temperature: -55℃~+125℃
C4 C5 C23 = CL10B104KB8NNNC: 容值:100nF;精度:±10%;额定电压:50V;材质(温度系数):X7R;; LCSC Part Name: 100nF ±10% 50V; Supplier Part: C1591; Manufacturer: SAMSUNG(三星); Supplier Footprint: 0603; JLCPCB Part Class: Extended Part; Datasheet: https://atta.szlcsc.com/upload/public/pdf/source/20160218/1457707763339.pdf; Supplier: LCSC; Tolerance: ±10%; Voltage Rated: 50V; Temperature Coefficient: X7R
C24 = CL10C101JB8NNNC: 容值:100pF;精度:±5%;额定电压:50V;材质(温度系数):C0G;; LCSC Part Name: 100pF ±5% 50V; Supplier Part: C14858; Manufacturer: SAMSUNG(三星); Supplier Footprint: 0603; JLCPCB Part Class: Basic Part; Datasheet: https://atta.szlcsc.com/upload/public/pdf/source/20160218/1457707763339.pdf; Supplier: LCSC; Tolerance: ±5%; Voltage Rated: 50V; Temperature Coefficient: C0G
R9-R12 R14-R21 R26-R29 = 0603WAF1001T5E: 电阻类型:厚膜电阻;阻值:1kΩ;精度:±1%;功率:100mW;最大工作电压:75V;温度系数:±100ppm/℃;; LCSC Part Name: 1kΩ ±1% 100mW 厚膜电阻; Supplier Part: C21190; Manufacturer: UNI-ROYAL(厚声); Supplier Footprint: 0603; JLCPCB Part Class: Basic Part; Datasheet: https://atta.szlcsc.com/upload/public/pdf/source/20200306/C422600_1E6D84923E4A46A82E41ADD87F860B5C.pdf; Supplier: LCSC; Type: 厚膜电阻; Tolerance: ±1%; Power(Watts): 100mW; Overload Voltage (Max): 75V; Temperature Coefficient: ±100ppm/℃; Operating Temperature Range: -55℃~+155℃
R2 R4 R13 R24 R25 R31 R33 = 0603WAF0000T5E: 电阻类型:厚膜电阻;阻值:0Ω;精度:±1%;功率:100mW;最大工作电压:75V;工作温度范围:-55℃~+155℃;; LCSC Part Name: 0Ω±1%100mW; Supplier Part: C21189; Manufacturer: UNI-ROYAL(厚声); Supplier Footprint: 0603; JLCPCB Part Class: BasicPart; Datasheet: https://atta.szlcsc.com/upload/public/pdf/source/20200306/C422600_1E6D84923E4A46A82E41ADD87F860B5C.pdf; Supplier: LCSC; Type: 厚膜电阻; Tolerance: ±1%; Power(Watts): 100mW; Overload Voltage (Max): 75V; Operating Temperature Range: -55℃~+155℃
R22 R23 R30 R32 R34 = 0603WAF1000T5E: 电阻类型:厚膜电阻;阻值:100Ω;精度:±1%;功率:100mW;最大工作电压:75V;温度系数:±200ppm/℃;; LCSC Part Name: 100Ω ±1% 100mW 厚膜电阻; Supplier Part: C22775; Manufacturer: UNI-ROYAL(厚声); Supplier Footprint: 0603; JLCPCB Part Class: Basic Part; Datasheet: https://atta.szlcsc.com/upload/public/pdf/source/20200306/C422600_1E6D84923E4A46A82E41ADD87F860B5C.pdf; Supplier: LCSC; Type: 厚膜电阻; Tolerance: ±1%; Power(Watts): 100mW; Overload Voltage (Max): 75V; Temperature Coefficient: ±200ppm/℃; Operating Temperature Range: -55℃~+155℃
U3 U4 = ADS1256IDBR: 接口:SPI;电源电压:5V;采样率:30kHz;分辨率:24位;; LCSC Part Name: 4或8通道 30kHz 24位ADC SPI接口; Supplier Part: C28186; Manufacturer: TI(德州仪器); Supplier Footprint: SSOP-28-208mil; JLCPCB Part Class: Extended Part; Datasheet: https://www.ti.com/cn/lit/gpn/ads1256; Supplier: LCSC; Interface: SPI; differential input: 是; number of channels: 4；8; Supply Voltage: 5V; sampling frequency: 30kHz; resolution: 24位; Operating Temperature: -40℃~+85℃
U5 = TL431BIDBZR: 输出类型:可调;输出电压:2.495V~36V;输出电流:100mA;精度:±0.5%;; Supplier Part: C41283; Manufacturer: TI(德州仪器); Supplier Footprint: SOT-23; JLCPCB Part Class: Extended Part; Datasheet: https://www.ti.com/cn/lit/gpn/tl431; Supplier: LCSC; Output Type: 可调; Output Voltage: 2.495V~36V; Output Current: 100mA; Tolerance: ±0.5%; Reference Type: 并联; Minimum Cathode Current for Regulation: 700uA; Operating Temperature: -40℃~+85℃@(TA)
X1-X3 = CSTNE8M00G520000R0: LCSC Part Name: 8.000MHz10pF; Supplier Part: C907975; Manufacturer: muRata(村田); Supplier Footprint: SMD; JLCPCB Part Class: ExtendedPart; Datasheet: https://atta.szlcsc.com/upload/public/pdf/source/20201022/C907975_BE77A173E35C03920A12013DDB2B8858.pdf; Supplier: LCSC
C25-C29 = CL10A105KB8NNNC: 容值:1uF;精度:±10%;额定电压:50V;材质(温度系数):X5R;; LCSC Part Name: 1uF ±10% 50V; Supplier Part: C15849; Manufacturer: SAMSUNG(三星); Supplier Footprint: 0603; JLCPCB Part Class: Basic Part; Datasheet: https://atta.szlcsc.com/upload/public/pdf/source/20160218/1457707763339.pdf; Supplier: LCSC; Tolerance: ±10%; Voltage Rated: 50V; Temperature Coefficient: X5R
R1 R3 R35-R50 = 0603WAF1002T5E: 电阻类型:厚膜电阻;阻值:10kΩ;精度:±1%;功率:100mW;温度系数:±100ppm/℃;最大工作电压:75V;工作温度范围:-55℃~+155℃;; LCSC Part Name: 10kΩ±1%100mW; Supplier Part: C25804; Manufacturer: UNI-ROYAL(厚声); Supplier Footprint: 0603; JLCPCB Part Class: BasicPart; Datasheet: https://atta.szlcsc.com/upload/public/pdf/source/20200306/C422600_1E6D84923E4A46A82E41ADD87F860B5C.pdf; Supplier: LCSC; Type: 厚膜电阻; Tolerance: ±1%; Power(Watts): 100mW; Temperature Coefficient: ±100ppm/℃; Overload Voltage (Max): 75V; Operating Temperature Range: -55℃~+155℃
U6 = PCA9548APW,118: LCSC Part Name: 8通道I2C开关复位; Supplier Part: C21198; Manufacturer: NXP(恩智浦); Supplier Footprint: TSSOP-24; JLCPCB Part Class: Extended Part; Supplier: LCSC
U7-U11 = DRV2605LDGSR: DRV2605L 具有 2V 工作电压、波形库和自动谐振跟踪功能的 ERM/LRA 触觉驱动器; LCSC Part Name: 5.5V电机驱动芯片; Supplier Part: C527464; Manufacturer: TI(德州仪器); Supplier Footprint: VSSOP-10-0.5mm; JLCPCB Part Class: Extended Part; Datasheet: https://www.ti.com/cn/lit/gpn/drv2605l; Supplier: LCSC
C1 C2 = TAJC106K035RNJ: 容值:10uF;精度:±10%;额定电压:35V;等效串联电阻:1.6Ω@100kHz;; LCSC Part Name: 10uF ±10% 35V; Supplier Part: C7211; Manufacturer: Kyocera AVX; Supplier Footprint: CASE-C-6032; JLCPCB Part Class: Extended Part; Datasheet: https://atta.szlcsc.com/upload/public/pdf/source/20160107/1457707750344.pdf; Supplier: LCSC; Tolerance: ±10%; Rated Voltage: 35V; Equivalent Series Resistance(ESR): 1.6Ω@100kHz; Operating Temperature: -55℃~+125℃
C3 = CL10A475KO8NNNC: 容值:4.7uF;精度:±10%;额定电压:16V;材质(温度系数):X5R;; LCSC Part Name: 4.7uF ±10% 16V; Supplier Part: C19666; Manufacturer: SAMSUNG(三星); Supplier Footprint: 0603; JLCPCB Part Class: Basic Part; Datasheet: https://atta.szlcsc.com/upload/public/pdf/source/20160218/1457707763339.pdf; Supplier: LCSC; Tolerance: ±10%; Voltage Rated: 16V; Temperature Coefficient: X5R
H1 = PZ254V-11-04P: 插针结构:1x4P;间距:2.54mm;行距:-;圆针/方针:方针;安装类型:直插;排数:单排;总PIN位数:4P;额定电流:3A;额定电压:250V;配合针长度:6mm;塑高:2.5mm;端接针长度:3mm;触头材质:-;工作温度范围:-40℃~+105℃;颜色:黑色;; LCSC Part Name: 间距:2.54mm 1x4P 直插 方针; Supplier Part: C2691448; Manufacturer: XFCN(兴飞); Supplier Footprint: 插件,P=2.54mm; JLCPCB Part Class: Extended Part; Datasheet: https://atta.szlcsc.com/upload/public/pdf/source/20200309/C492403_F9F19131791D08044AD4F84F8E751A34.pdf; Supplier: LCSC; Pin Structure: 1x4P; Pitch: 2.54mm; Circluar Pins/Square Pins: 方针; Mounting Type: 直插; Number of Rows: 单排; Number of Pins: 4P; Current Rating (Max): 3A; Voltage Rating (Max): 250V; Length of Mating Pin: 6mm; Insulation Height: 2.5mm; Length of End Connection Pin: 3mm; Operating Temperature Range: -40℃~+105℃; Color: 黑色
H2-H5 = PZ254V-11-02P: 插针结构:1x2P;间距:2.54mm;行距:-;圆针/方针:方针;安装方式:直插;排数:单排;总PIN位数:2P;额定电流:-;额定电压:-;配合针长度:6mm;塑高:2.5mm;端接针长度:3mm;触头材质:黄铜;触头镀层:-;工作温度:-40℃~+105℃;颜色:黑色;; LCSC Part Name: 1x2P 间距:2.54mm 方针 直插; Supplier Part: C492401; Manufacturer: XFCN(兴飞); Supplier Footprint: 插件,P=2.54mm; JLCPCB Part Class: Extended Part; Datasheet: https://atta.szlcsc.com/upload/public/pdf/source/20200309/C492401_A812433581A9B211A7FFA413ADDFF0E5.pdf; Supplier: LCSC; Pin Structure: 1x2P; Pitch: 2.54mm; Circluar Pins/Square Pins: 方针; Mounting Type: 直插; Number of Rows: 单排; Number of Pins: 2P; Length of Mating Pin: 6mm; Insulation Height: 2.5mm; Length of End Connection Pin: 3mm; Contact Material: 黄铜; Operating Temperature: -40℃~+105℃; Color: 黑色
LED1 LED2 = NCD0603R1_C84263: 灯头类型:-;发光颜色:红色;正向压降(Vf):1.6V~2.6V;功率:65mW;正向电流:25mA;波长:615nm~630nm;二极管配置:独立二极管;透镜颜色:-;色温:-;发光强度:80mcd~220mcd;发光角度:130°;载带方式:-;工作温度:-30℃~+85℃;; Supplier Part: C84263; Manufacturer: 国星光电; Supplier Footprint: 0603; JLCPCB Part Class: Extended Part; Datasheet: https://atta.szlcsc.com/upload/public/pdf/source/20200820/C84263_DABC6A75E58F576973B407FDBA283D60.pdf; Supplier: LCSC; Illumination Color: 红色; Voltage - Forward(Vf): 1.6V~2.6V; Power(Watts): 65mW; Forward Current: 25mA; Wavelength - Dominant: 615nm~630nm; Diode Configuration: 独立二极管; Luminous Intensity: 80mcd~220mcd; Viewing Angle: 130°; Operating Temperature: -30℃~+85℃
LED3 LED4 = NCD0603G1: 发光颜色:翠绿色;正向压降(Vf):2.6V~3.6V;功率:72mW;正向电流:20mA;波长:515nm~530nm;透镜颜色:-;发光强度:330mcd~900mcd;发光角度:130°;工作温度:-30℃~+85℃;; Supplier Part: C84267; Manufacturer: 国星光电; Supplier Footprint: 0603; JLCPCB Part Class: Extended Part; Datasheet: https://atta.szlcsc.com/upload/public/pdf/source/20200820/C84267_04BA7703640BAC111D09F5EFB971FBF3.pdf; Supplier: LCSC; Illumination Color: 翠绿色; Voltage - Forward(Vf): 2.6V~3.6V; Power(Watts): 72mW; Forward Current: 20mA; Wavelength - Dominant: 515nm~530nm; Luminous Intensity: 330mcd~900mcd; Viewing Angle: 130°; Operating Temperature: -30℃~+85℃
R5-R8 = 0603WAF4701T5E: 电阻类型:厚膜电阻;阻值:4.7kΩ;精度:±1%;功率:100mW;最大工作电压:75V;温度系数:±100ppm/℃;; LCSC Part Name: 4.7kΩ ±1% 100mW 厚膜电阻; Supplier Part: C23162; Manufacturer: UNI-ROYAL(厚声); Supplier Footprint: 0603; JLCPCB Part Class: Basic Part; Datasheet: https://atta.szlcsc.com/upload/public/pdf/source/20200306/C422600_1E6D84923E4A46A82E41ADD87F860B5C.pdf; Supplier: LCSC; Type: 厚膜电阻; Tolerance: ±1%; Power(Watts): 100mW; Overload Voltage (Max): 75V; Temperature Coefficient: ±100ppm/℃; Operating Temperature Range: -55℃~+155℃
U1 = LM1117MPX-3.3/NOPB: 输出类型:固定;最大输入电压:15V;输出电压:3.3V;输出电流:800mA;电源纹波抑制比(PSRR):75dB@(120Hz);输出极性:正极;; LCSC Part Name: 800mA 15V 线性稳压器; Supplier Part: C9662; Manufacturer: TI(德州仪器); Supplier Footprint: SOT-223-4; JLCPCB Part Class: Extended Part; Datasheet: http://www.ti.com/cn/lit/gpn/lm1117; Supplier: LCSC; Output Type: 固定; Maximum Input Voltage: 15V; Output Voltage: 3.3V; Output Current: 800mA; Power Supply Rejection Ratio (PSRR): 75dB@(120Hz); Dropout Voltage: 1.2V@(800mA); Feature: 防静电保护；热保护(TSD)；过流保护(OCP)；带使能; Output Polarity: 正极; Number of Outputs: 1
U2 = STM32F042K6T6: CPU内核:ARM-M0;CPU最大主频:48MHz;应用领域:-;; LCSC Part Name: 主流ARM Cortex-M0 USB系列MCU，具有32 KB Flash、48 MHz CPU、USB、CAN和CEC功能; Supplier Part: C69216; Manufacturer: ST(意法半导体); Supplier Footprint: LQFP-32(7x7); JLCPCB Part Class: Extended Part; Datasheet: https://atta.szlcsc.com/upload/public/pdf/source/20161226/1482720143189.pdf; Supplier: LCSC; CPU Core: ARM-M0; CPU Maximum Speed: 48MHz; Program Storage Size: 32KB; Program Memory Type: FLASH; Number of I/O: 26; ADC (Bit): 12bit; Low Voltage Detection Threshold: 1.65V~3.6V

## Nets
GND: C1.2 C2.2 C3.1 C4.1 C5.1 C6.1 C7.1 C8.1 C9.1 C10.1 C11.1 C12.1 C13.1 C14.1 C15.1 C16.1 C17.1 C18.1 C19.1 C20.1 C21.1 C22.2 C23.1 C24.1 C25.2 C26.2 C27.2 C28.2 C29.2 CN1.3 H1.4 H4.1 H4.2 H5.1 H5.2 H7.3 R4.1 R5.1 R6.1 R7.1 R8.1 R35.1 R36.1 R39.1 U1.1(ADJ/GND) U2.16(VSS) U2.32(VSS) U3.2(AGND) U3.3(VREFN) U3.5(AINCOM) U3.17(DGND) U4.2(AGND) U4.3(VREFN) U4.5(AINCOM) U4.17(DGND) U5.3(ANODE) U6.12(VSS) U7.4(IN/TRIG) U7.8(GND) U8.4(IN/TRIG) U8.8(GND) U9.4(IN/TRIG) U9.8(GND) U10.4(IN/TRIG) U10.8(GND) U11.4(IN/TRIG) U11.8(GND) U12.3 U13.3 U14.3 U15.3 U16.3 U16.4 U17.3 U17.4 U18.3 U19.3 U20.3 U21.3 U22.3 U22.4 U23.3 U23.4 U24.3 U25.3 U26.3 U27.3 U28.3 U28.4 U29.3 U30.3 U31.3 U32.3 U33.2 U33.7 U33.8 X1.2(GND) X2.2(GND) X3.2(GND)
PGND: CN5.1(-) H7.1
PVCC: CN5.2(+) H6.1
VCC_3V3: C2.1 C4.2 C5.2 H1.1 H3.1 H3.2 LED2.2(A) R1.2 R2.2 R13.2 R25.2 R37.2 R38.2 R40.2 R41.2 R42.2 R43.2 R44.2 R45.2 R46.2 R47.2 R48.2 R49.2 R50.2 U1.2(OUT) U1.4(TAB) U2.1(VDD) U2.5(VDDA) U2.17(VDDIO2) U3.14(SYNCPDWN) U3.16(DVDD) U4.14(SYNCPDWN) U4.16(DVDD) U6.24(VDD) U7.5(EN) U7.6(VDD/NC) U7.10(VDD) U8.5(EN) U8.6(VDD/NC) U8.10(VDD) U9.5(EN) U9.6(VDD/NC) U9.10(VDD) U10.5(EN) U10.6(VDD/NC) U10.10(VDD) U11.5(EN) U11.6(VDD/NC) U11.10(VDD) U12.1 U13.1 U14.1 U15.1 U18.1 U19.1 U20.1 U21.1 U24.1 U25.1 U26.1 U27.1 U29.1 U30.1 U31.1 U32.1
VCC_5V: C1.1 H2.1 H2.2 H6.3 LED1.2(A) R34.1 U1.3(IN) U3.1(AVDD) U4.1(AVDD) U33.5
VCC_N: CN6.1(-) CN6.3 CN6.4 U33.1
VCC_P: CN6.2(+) U33.4
A0: R35.2 U6.1(A0)
A1: R36.2 U6.2(A1)
A2: R39.2 U6.21(A2)
ADS1256_DRDY1: R31.1 U2.14(PB0)
ADS1256_DRDY2: R33.1 U2.15(PB1)
AIN0: C6.2 R9.1 U3.6(AIN0)
AIN1: C7.2 R10.1 U3.7(AIN1)
AIN2: C8.2 R11.1 U3.8(AIN2)
AIN3: C9.2 R12.1 U3.9(AIN3)
AIN4: C10.2 R14.1 U3.10(AIN4)
AIN5: C11.2 R15.1 U3.11(AIN5)
AIN6: C12.2 R16.1 U3.12(AIN6)
AIN7: C13.2 R17.1 U3.13(AIN7)
AIN8: C14.2 R18.1 U4.6(AIN0)
AIN9: C15.2 R19.1 U4.7(AIN1)
AIN10: C16.2 R20.1 U4.8(AIN2)
AIN11: C17.2 R21.1 U4.9(AIN3)
AIN12: C18.2 R26.1 U4.10(AIN4)
AIN13: C19.2 R27.1 U4.11(AIN5)
AIN14: C20.2 R28.1 U4.12(AIN6)
AIN15: C21.2 R29.1 U4.13(AIN7)
BOOT0: R3.2 U2.31(PB8/BOOT0)
CS1: R30.1 U3.20(CS)
CS2: R32.1 U4.20(CS)
DEBUG_LED1: LED3.2(A) U2.27(PB4)
DEBUG_LED2: LED4.2(A) U2.28(PB5)
DIN: R23.1 U3.23(DIN) U4.23(DIN)
DOUT: R24.2 U3.22(DOUT) U4.22(DOUT)
DRDY1: R31.2 U3.21(DRDY)
DRDY2: R33.2 U4.21(DRDY)
ENC0: R9.2 U12.2
ENC1: R10.2 U13.2
ENC2: R11.2 U14.2
ENC3: R12.2 U15.2
ENC4: R14.2 U18.2
ENC5: R15.2 U19.2
ENC6: R16.2 U20.2
ENC7: R17.2 U21.2
ENC8: R18.2 U24.2
ENC9: R19.2 U25.2
ENC10: R20.2 U26.2
ENC11: R21.2 U27.2
ENC12: R26.2 U29.2
ENC13: R27.2 U30.2
ENC14: R28.2 U31.2
ENC15: R29.2 U32.2
I2C_SCL: R38.1 U2.19(PA9) U6.22(SCL)
I2C_SDA: R37.1 U2.20(PA10) U6.23(SDA)
LRA0_N: U7.9(OUT-) U16.2
LRA0_P: U7.7(OUT+) U16.1
LRA1_N: U8.9(OUT-) U17.2
LRA1_P: U8.7(OUT+) U17.1
LRA2_N: U9.9(OUT-) U22.2
LRA2_P: U9.7(OUT+) U22.1
LRA3_N: U10.9(OUT-) U23.2
LRA3_P: U10.7(OUT+) U23.1
LRA4_N: U11.9(OUT-) U28.2
LRA4_P: U11.7(OUT+) U28.1
MDATA: CN2.3 CN3.3 CN4.3
MGND: CN2.1 CN3.1 CN4.1 H7.2
MVDD: CN2.2 CN3.2 CN4.2 H6.2
NRST: C3.2 R1.1 U2.4(NRST)
OSC_IN: U2.2(PF0/OSC_IN) X1.1(IN)
OSC_OUT: U2.3(PF1/OSC_OUT) X1.3(OUT)
SC3: R42.1 U6.11(SC3) U7.2(SCL)
SC4: R44.1 U6.14(SC4) U8.2(SCL)
SC5: R46.1 U6.16(SC5) U9.2(SCL)
SC6: R48.1 U6.18(SC6) U10.2(SCL)
SC7: R50.1 U6.20(SC7) U11.2(SCL)
SCLK: R22.1 U3.24(SCLK) U4.24(SCLK)
SD3: R41.1 U6.10(SD3) U7.3(SDA)
SD4: R43.1 U6.13(SD4) U8.3(SDA)
SD5: R45.1 U6.15(SD5) U9.3(SDA)
SD6: R47.1 U6.17(SD6) U10.3(SDA)
SD7: R49.1 U6.19(SD7) U11.3(SDA)
SPI_CLK: R22.2 U2.11(PA5)
SPI_CS1: R30.2 U2.9(PA3)
SPI_CS2: R32.2 U2.10(PA4)
SPI_MISO: R24.1 U2.12(PA6)
SPI_MOSI: R23.2 U2.13(PA7)
SWCLK: H1.3 U2.24(PA14)
SWDIO: H1.2 U2.23(PA13)
USART1_RX: CN1.1 U2.30(PB7)
USART1_TX: CN1.2 U2.29(PB6)
VREF: C22.1 C23.2 C24.2 R34.2 U3.4(VREFP) U4.4(VREFP) U5.1(CATHODE) U5.2(REF)
$1N612: R2.1 R3.1 R4.2
$1N1084: LED2.1(K) R6.2
$1N1088: LED3.1(K) R7.2
$1N1092: LED4.1(K) R8.2
$1N1095: LED1.1(K) R5.2
$2N619: R13.1 U3.15(RESET)
$2N6200: R25.1 U4.15(RESET)
$2N12226: U3.18(XTAL2) X2.3(OUT)
$2N12237: U3.19(XTAL1CLKIN) X2.1(IN)
$2N12302: U4.18(XTAL2) X3.3(OUT)
$2N12311: U4.19(XTAL1CLKIN) X3.1(IN)
$3N428: R40.1 U6.3(/RESET)
$3N4299: C25.1 U7.1(REG)
$3N4649: C26.1 U8.1(REG)
$3N4999: C27.1 U9.1(REG)
$3N5647: C28.1 U10.1(REG)
$3N5690: C29.1 U11.1(REG)

Not connected (* = marked no-connect by the designer): U2 6(PA0)* 7(PA1)* 8(PA2)* 18(PA8)* 21(PA11)* 22(PA12)* 25(PA15)* 26(PB3)*; U3 25(D0CLKOUT)* 26(D1)* 27(D2)* 28(D3)*; U4 25(D0CLKOUT)* 26(D1)* 27(D2)* 28(D3)*; U6 4(SD0)* 5(SC0)* 6(SD1)* 7(SC1)* 8(SD2)* 9(SC2)*; U33 3* 6*

## Notes on the sheets
sheet 1
- 5V-3.3V LDO
- Test Point
sheet 5
- UART
- U2D2
- PWR
